# EAGLE board artemis_board (EAGLE 9.5.1), part 1 of 2
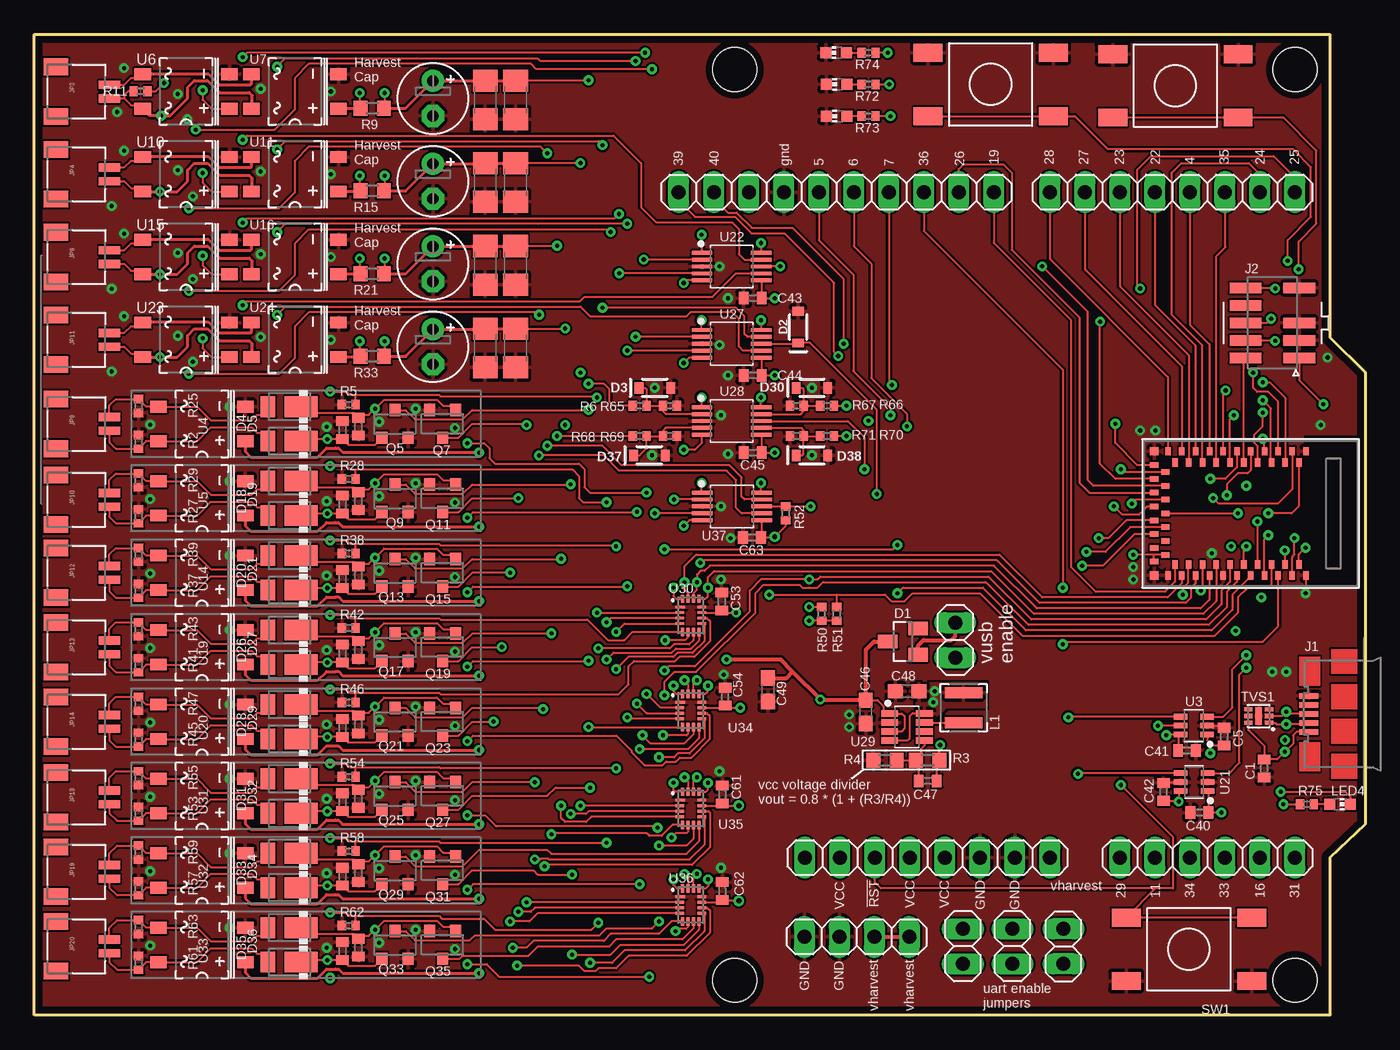
[diagram p6: board, top side]
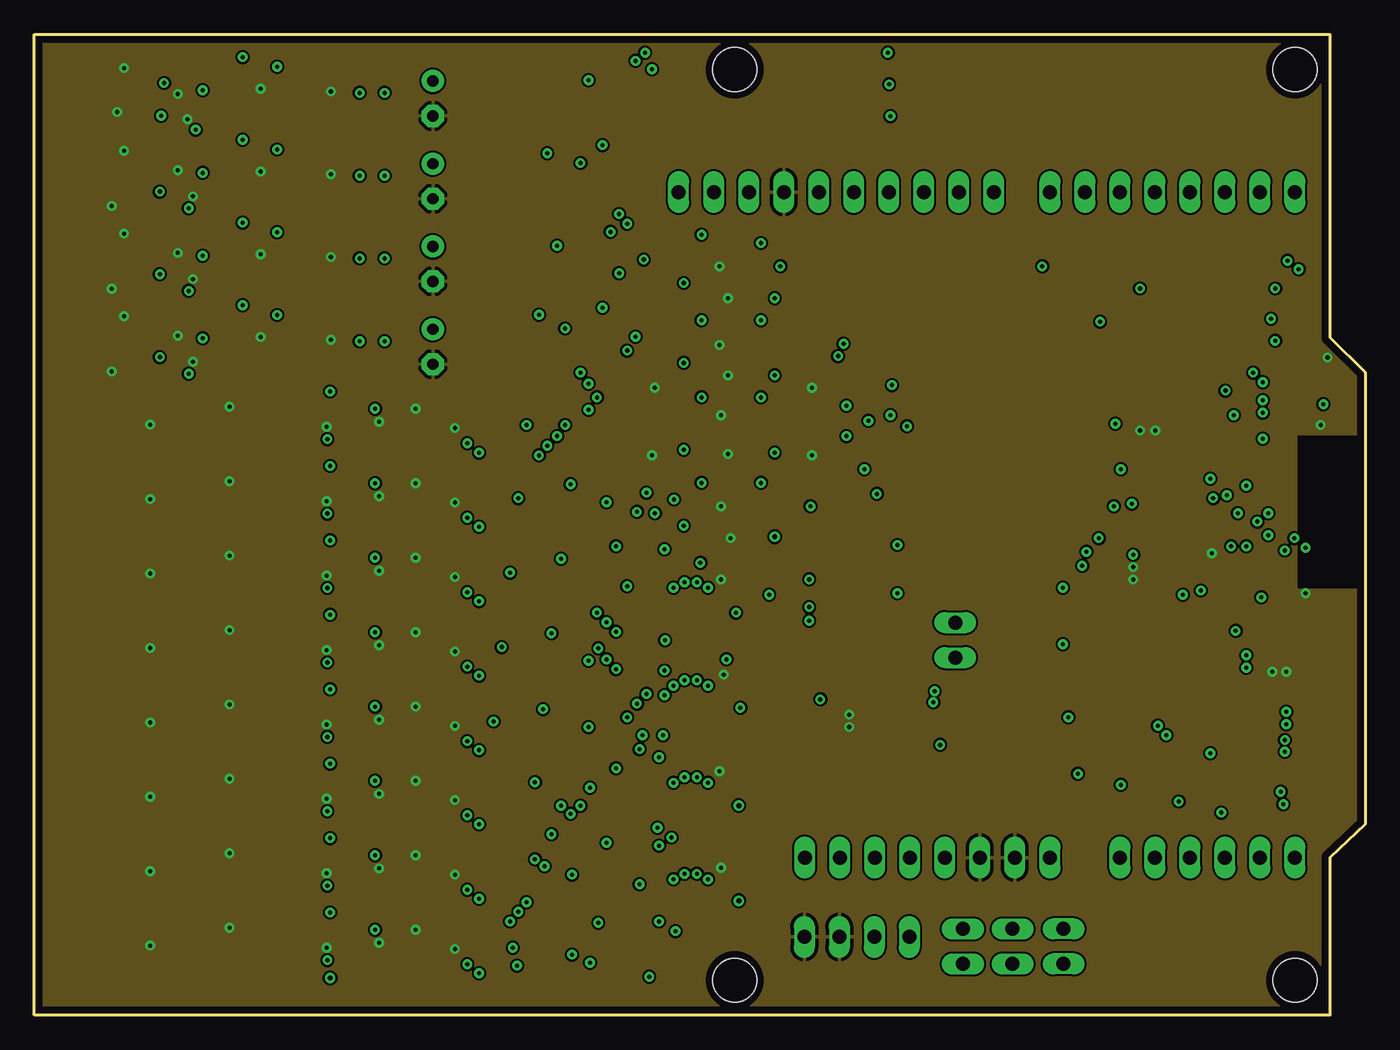
[diagram p7: board, inner layer Route2]
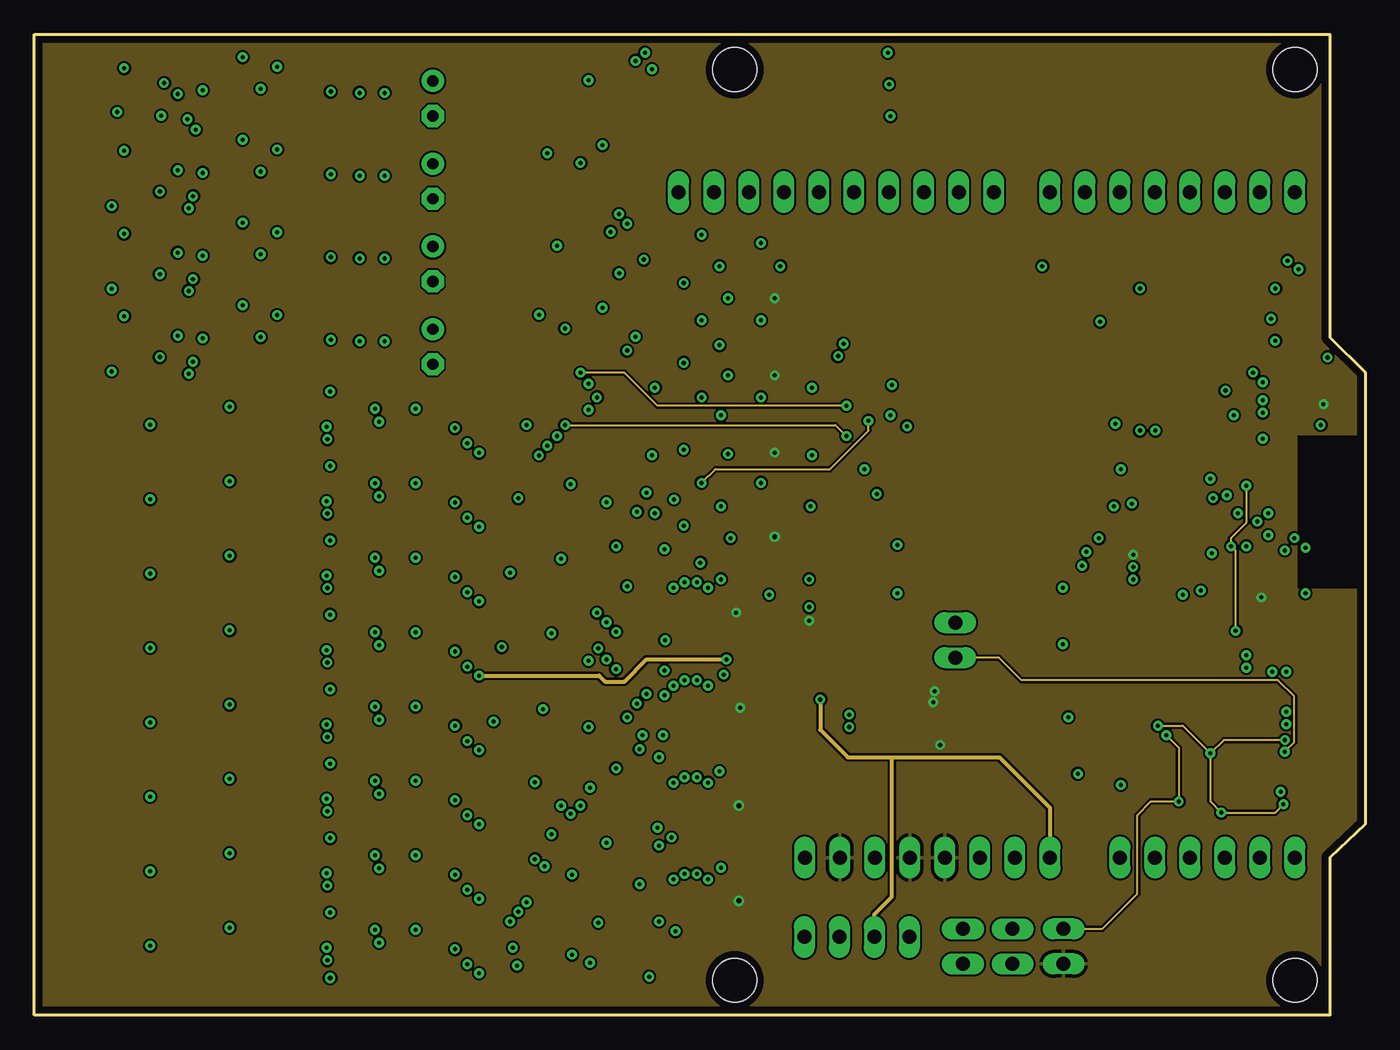
[diagram p8: board, inner layer Route15]
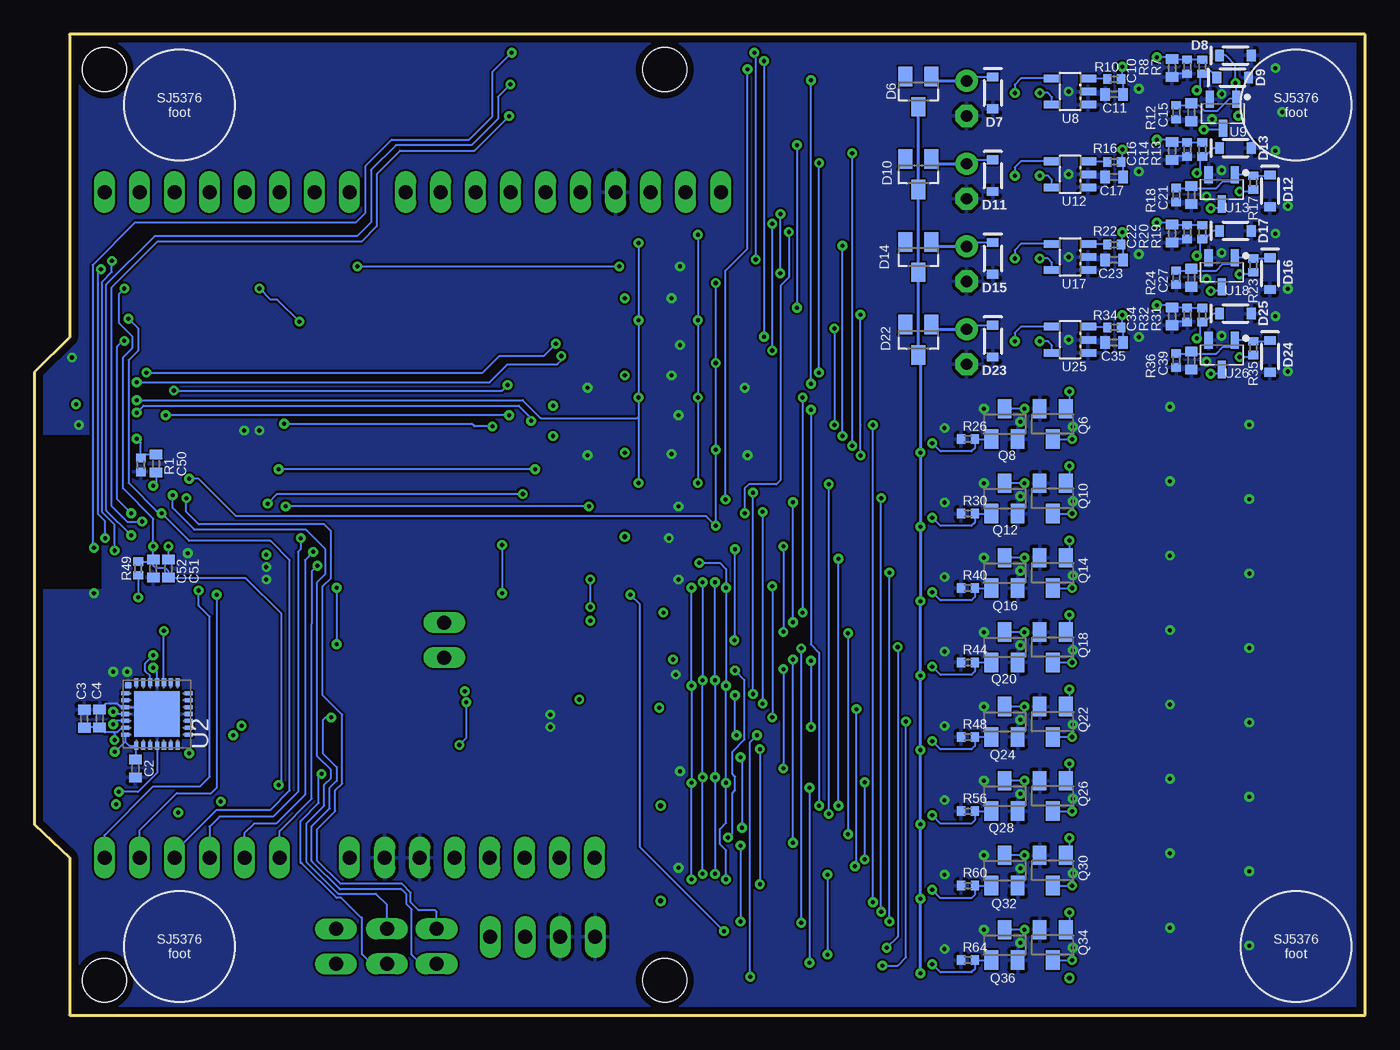
[diagram p9: board, bottom side, seen from below]

Size 96.52 x 71.12 mm. Coordinates in mm from the lower left corner, seen from the top.
Outline: 0,71.12 93.98,71.12 93.98,49.15 96.52,46.61 96.52,13.84 93.98,11.43 93.98,0 0,0 0,71.12
Copper layers (1+2*15+16): Top 0.035mm / dielectric 1.5mm / Route2 0.035mm / dielectric 0.15mm / Route15 0.035mm / dielectric 0.2mm / Bottom 0.035mm
Design rules "default *": minimum track width 6mil, minimum drill 0.3mm, track to track 6mil, track to pad 6mil, pad to pad 6mil, via to via 6mil, smd to smd 6mil, copper to edge 20mil, drill to drill 6mil, minimum pad ring 10mil, minimum via ring 8mil, stop-mask expansion 4mil, vias tented up to drill 0.3mm, thermal gap 10mil
Holes 3.17 mm at 50.8,2.54 91.44,2.54 50.8,68.58 91.44,68.58

## Footprints (pad centres in the part's own frame; a part is rotated, then mirrored left to right if it is on the bottom)
C0402 = smd 0.7 x 0.9: 1 -0.65,0; 2 0.65,0
C1206 = smd 1.6 x 1.8: 1 -1.4,0; 2 1.4,0
E2,5-5 = drill 0.813 pad 1.6: + -1.27,0 | drill 0.813 pad 1.6 octagon: - 1.27,0
C0603 = smd 1.1 x 1: 1 -0.85,0; 2 0.85,0
SOT23 = smd 1 x 1.4: 1 -0.95,-1.1; 2 0.95,-1.1; 3 0,1.1
SOD-323 = smd 0.63 x 0.83: A 1.15,0; C -1.15,0
DFLU1200 = smd 1.05 x 1.5: A -1.55,0 | smd 2.4 x 1.5: K 0.85,0
10118192-0001LF = smd 0.4 x 1.35: 1 -1.29,2.56; 2 -0.64,2.56; 3 0.01,2.56; 4 0.66,2.56; 5 1.31,2.56
FTSH-105-01-F-DV-007-K-P = smd 2.3 x 0.75: P$1 1.95,-2.54; P$2 -1.95,-2.54; P$3 1.95,-1.27; P$4 -1.95,-1.27; P$5 1.95,0; P$6 -1.95,0; P$8 -1.95,1.27; P$9 1.95,2.54; P$10 -1.95,2.54
1X02 = drill 1.016 long: 1 -1.27,0; 2 1.27,0
1X08 = drill 1.016 long: 1 -8.89,0; 2 -6.35,0; 3 -3.81,0; 4 -1.27,0; 5 1.27,0; 6 3.81,0; 7 6.35,0; 8 8.89,0
JST-SH-2 = smd 0.6 x 1.55: 1 -0.5,2.34; 2 0.5,2.34 | smd 1.2 x 1.8: P-MOUNT1 -1.8,-1.535; P-MOUNT2 1.8,-1.535
1X10 = drill 1.016 long: 1 -11.43,0; 2 -8.89,0; 3 -6.35,0; 4 -3.81,0; 5 -1.27,0; 6 1.27,0; 7 3.81,0; 8 6.35,0; 9 8.89,0; 10 11.43,0
1X06 = drill 1.016 long: 1 -6.35,0; 2 -3.81,0; 3 -1.27,0; 4 1.27,0; 5 3.81,0; 6 6.35,0
1X04 = drill 1.016 long: 1 -3.81,0; 2 -1.27,0; 3 1.27,0; 4 3.81,0
LQH3NPNXXXXMEX = smd 0.8 x 2.7: P$1 -1.1,0; P$2 1.1,0
CHIP-LED0603 = smd 0.8 x 0.8: A 0,-0.75; C 0,0.75
2N7002K-7 = smd 0.8 x 0.9: D 0,1; G -0.95,-1; S 0.95,-1
BSS138K = smd 1 x 1.4: D 0,1.1; G -0.95,-1.1; S 0.95,-1.1
R0402 = smd 0.6 x 0.7: 1 -0.5,0; 2 0.5,0
R0603 = smd 1 x 1.1: 1 -0.85,0; 2 0.85,0
TE_FSMJSMA = smd 1.3 x 2.1: P$1 -2.3,4.55; P$2 -2.3,-4.55; P$3 2.3,4.55; P$4 2.3,-4.55
RCLAMP3654PATCT = smd 0.3 x 0.6: P$1 -0.5,-0.75; P$2 0,-0.75; P$3 0.5,-0.75; P$4 0.5,0.75; P$5 0,0.75; P$6 -0.5,0.75 | smd 1.3 x 0.45: PAD 0,0
ARTEMIS_FP = smd 0.4 x 0.6: AD16 -4,-3.7; BOOT 1.5,4.5; D0 0.5,-4.5; D1 -0.5,-4.5; D2 -1,-3.7; D3 2,-3.7; D7 -1.5,4.5; D8 -0.5,4.5; D9 2,3.7; D10 1,3.7; D14 -5,3.7; D17 -3.5,-4.5; D36 2.5,-4.5; D38 3,-3.7; D40 2.5,4.5; D41 -2.5,-4.5; GND@1 4.5,4.5; GND@39 -5.5,-4.5; GND@47 -1.5,-4.5; GND@59 4.5,-4.5; RXI-0 3.5,4.5; SWDCK 4,3.7; SWDIO 0,3.7; TXO-0 0.5,4.5; ~AD31 -3,-3.7; ~AD35 -2,3.7; ~D4 -2.5,4.5; ~D5 -1,3.7; ~D18 -4.5,-4.5; ~D19 -5,-3.7; ~D22 -3.5,4.5; ~D23 -4,3.7; ~D24 -3,3.7; ~D27 -4.5,4.5; ~D28 -5.5,4.5; ~D37 3.5,-4.5; ~D39 3,3.7; ~D42 1.5,-4.5; ~D43 1,-3.7; ~D44 4,-3.7; ~D45 -2,-3.7; ~RST 0,-3.7 | smd 0.6 x 0.4: AD34 -6.5,-0.5; D15 -6.5,0.5; VDD@36 -5.7,-3; VDD@37 -6.5,-3.5; XI -6.5,-2.5; XO -5.7,-2; ~AD11 -5.7,-1; ~AD12 -5.7,2; ~AD13 -5.7,1; ~AD29 -6.5,-1.5; ~AD32 -5.7,3; ~AD33/SWO -5.7,0; ~D6 -6.5,3.5; ~D25 -6.5,2.5; ~D26 -6.5,1.5 | smd 0.6 x 0.6: GND@22 -6.5,4.5; GND@38 -6.5,-4.5
MLP28 = smd 0.6 x 0.3: 1 -2.3,1.5; 2 -2.3,1; 3 -2.3,0.5; 4 -2.3,0; 5 -2.3,-0.5; 6 -2.3,-1; 7 -2.3,-1.5; 15 2.3,-1.5; 16 2.3,-1; 17 2.3,-0.5; 18 2.3,0; 19 2.3,0.5; 20 2.3,1; 21 2.3,1.5 | smd 0.3 x 0.6: 8 -1.5,-2.3; 9 -1,-2.3; 10 -0.5,-2.3; 11 0,-2.3; 12 0.5,-2.3; 13 1,-2.3; 14 1.5,-2.3; 22 1.5,2.3; 23 1,2.3; 24 0.5,2.3; 25 0,2.3; 26 -0.5,2.3; 27 -1,2.3; 28 -1.5,2.3 | smd 3.3 x 3.3: EXP 0,0 | smd 0.435 x 0.435: M -2.103,2.103
SOT65P210X110-6N = smd 0.988 x 0.41: 1 -0.97,0.65; 2 -0.97,0; 3 -0.97,-0.65; 4 0.97,-0.65; 5 0.97,0; 6 0.97,0.65
CDBHDXX0L-G = smd 0.85 x 1.2: P$1 1.25,3.15; P$2 -1.25,3.15; P$3 -1.25,-3.15; P$4 1.25,-3.15
SOT23-5 = smd 0.55 x 1.2: 1 -0.95,-1.3; 2 0,-1.3; 3 0.95,-1.3; 4 0.95,1.3; 5 -0.95,1.3
TN2106K1-G = smd 1.24 x 0.589: D 1.056,0; G -1.056,0.95; S -1.056,-0.95
SOP50P490X110-10N = smd 1.471 x 0.28: 1 -2.15,1; 2 -2.15,0.5; 3 -2.15,0; 4 -2.15,-0.5; 5 -2.15,-1; 6 2.15,-1; 7 2.15,-0.5; 8 2.15,0; 9 2.15,0.5; 10 2.15,1
SOP65P280X145-8N = smd 1.209 x 0.475: 1 -1.253,0.975; 2 -1.253,0.325; 3 -1.253,-0.325; 4 -1.253,-0.975; 5 1.253,-0.975; 6 1.253,-0.325; 7 1.253,0.325; 8 1.253,0.975
UQFN16-RSV0016A = smd 0.7 x 0.2: P$1 -0.75,0.6 | smd 0.6 x 0.2: P$2 -0.8,0.2; P$3 -0.8,-0.2; P$4 -0.8,-0.6; P$9 0.8,-0.6; P$10 0.8,-0.2; P$11 0.8,0.2; P$12 0.8,0.6 | smd 0.2 x 0.6: P$5 -0.6,-1.2; P$6 -0.2,-1.2; P$7 0.2,-1.2; P$8 0.6,-1.2; P$13 0.6,1.2; P$14 0.2,1.2; P$15 -0.2,1.2; P$16 -0.6,1.2

## Placement (x,y rotation side)
C1  1u  [C0402]  89.2,17.9 270 top
C2  1u  [C0402]  89.2,17.9 270 bottom
C3  100n  [C0402]  92.9,21.5 90 bottom
C4  1u  [C0402]  91.79,21.52 90 bottom
C5  100n  [C0402]  86.3,20.2 90 top
C6  10n  [C0402]  22.35,42.43 90 top
C7  10n  [C0402]  23.5,42.68 270 top
C8  10n  [C0402]  22.35,37.03 90 top
C9  10n  [C0402]  23.5,37.28 270 top
C10  1n  [C0402]  14,68.68 270 bottom
C11  1n  [C0402]  18.2,66.78 180 bottom
C12  [C1206]  34.9,66.38 270 top
C13  DNP  [E2,5-5]  28.9,66.48 270 top
C14  [C1206]  32.7,66.38 270 top
C15  10n  [C0402]  12.6,65.48 270 bottom
C16  1n  [C0402]  14,62.68 270 bottom
C17  1n  [C0402]  18.2,60.78 180 bottom
C18  [C1206]  34.9,60.38 270 top
C19  DNP  [E2,5-5]  28.9,60.48 270 top
C20  [C1206]  32.7,60.38 270 top
C21  10n  [C0402]  12.6,59.48 270 bottom
C22  1n  [C0402]  14,56.68 270 bottom
C23  1n  [C0402]  18.2,54.78 180 bottom
C24  [C1206]  34.9,54.38 270 top
C25  DNP  [E2,5-5]  28.9,54.48 270 top
C26  [C1206]  32.7,54.38 270 top
C27  10n  [C0402]  12.6,53.48 270 bottom
C28  10n  [C0402]  22.35,31.63 90 top
C29  10n  [C0402]  23.5,31.88 270 top
C30  10n  [C0402]  22.35,26.23 90 top
C31  10n  [C0402]  23.5,26.48 270 top
C32  10n  [C0402]  22.35,20.83 90 top
C33  10n  [C0402]  23.5,21.08 270 top
C34  1n  [C0402]  14,50.68 270 bottom
C35  1n  [C0402]  18.2,48.78 180 bottom
C36  [C1206]  34.9,48.38 270 top
C37  DNP  [E2,5-5]  28.9,48.48 270 top
C38  [C1206]  32.7,48.38 270 top
C39  10n  [C0402]  12.6,47.48 270 bottom
C40  100n  [C0402]  84.5,14.7 180 top
C41  10n  [C0402]  83.6,19.2 0 top
C42  10n  [C0402]  81.9,16.2 90 top
C43  10n  [C0402]  52.1,52 180 top
C44  10n  [C0402]  52.1,46.4 180 top
C45  10n  [C0402]  52.1,40.8 180 top
C46  4.7u  [C0603]  60.3,22 270 top
C47  22p  [C0402]  64.8,17 180 top
C48  4.7u  [C0603]  63.3,23.5 180 top
C49  10u  [C0603]  53.2,23.6 270 top
C50  100n  [C0402]  87.7,40 90 bottom
C51  100n  [C0402]  86.8,32.4 270 bottom
C52  1n  [C0402]  87.9,32.4 270 bottom
C53  10n  [C0402]  49.85,30 90 top
C54  10n  [C0402]  50.1,23.1 90 top
C55  10n  [C0402]  22.35,15.45 90 top
C56  10n  [C0402]  23.5,15.7 270 top
C57  10n  [C0402]  22.35,10.05 90 top
C58  10n  [C0402]  23.5,10.3 270 top
C59  10n  [C0402]  22.35,4.65 90 top
C60  10n  [C0402]  23.5,4.9 270 top
C61  10n  [C0402]  49.9,16 90 top
C62  10n  [C0402]  49.9,9 90 top
C63  10n  [C0402]  52.05,34.65 180 top
D1  BAT54  [SOT23]  63,27.1 90 top
D2  3.3V  [SOD-323]  55.4,49.9 90 top
D3  3.3V  [SOD-323]  45,45.5 0 top
D4  DFLU1200  [DFLU1200]  18.5,41.63 0 top
D5  DFLU1200  [DFLU1200]  18.5,44.13 0 top
D6  BAT54  [SOT23]  32.4,66.98 180 bottom
D7  3.3V  [SOD-323]  27,66.88 270 bottom
D8  3.3V  [SOD-323]  9.4,69.6 0 bottom
D9  3.3V  [SOD-323]  9.6,68 0 bottom
D10  BAT54  [SOT23]  32.4,60.98 180 bottom
D11  3.3V  [SOD-323]  27,60.88 270 bottom
D12  3.3V  [SOD-323]  6.9,59.78 270 bottom
D13  3.3V  [SOD-323]  9.4,62.88 0 bottom
D14  BAT54  [SOT23]  32.4,54.98 180 bottom
D15  3.3V  [SOD-323]  27,54.88 270 bottom
D16  3.3V  [SOD-323]  6.9,53.78 270 bottom
D17  3.3V  [SOD-323]  9.4,56.88 0 bottom
D18  DFLU1200  [DFLU1200]  18.5,36.23 0 top
D19  DFLU1200  [DFLU1200]  18.5,38.73 0 top
D20  DFLU1200  [DFLU1200]  18.5,30.83 0 top
D21  DFLU1200  [DFLU1200]  18.5,33.33 0 top
D22  BAT54  [SOT23]  32.4,48.98 180 bottom
D23  3.3V  [SOD-323]  27,48.88 270 bottom
D24  3.3V  [SOD-323]  6.9,47.78 270 bottom
D25  3.3V  [SOD-323]  9.4,50.88 0 bottom
D26  DFLU1200  [DFLU1200]  18.5,25.43 0 top
D27  DFLU1200  [DFLU1200]  18.5,27.93 0 top
D28  DFLU1200  [DFLU1200]  18.5,20.03 0 top
D29  DFLU1200  [DFLU1200]  18.5,22.53 0 top
D30  3.3V  [SOD-323]  56.4,45.5 0 top
D31  DFLU1200  [DFLU1200]  18.5,14.65 0 top
D32  DFLU1200  [DFLU1200]  18.5,17.15 0 top
D33  DFLU1200  [DFLU1200]  18.5,9.25 0 top
D34  DFLU1200  [DFLU1200]  18.5,11.75 0 top
D35  DFLU1200  [DFLU1200]  18.5,3.85 0 top
D36  DFLU1200  [DFLU1200]  18.5,6.35 0 top
D37  3.3V  [SOD-323]  44.6,40.6 0 top
D38  3.3V  [SOD-323]  56.4,40.6 0 top
J1  10118192-0001LF  [10118192-0001LF]  95,21.84 90 top
J2  FTSH-105-01-F-DV-007-K-P  [FTSH-105-01-F-DV-007-K-P]  89.8,50.2 0 top
JP1  [1X02]  66.8,27.2 270 top
JP2  [1X08]  82.55,59.69 0 top
JP3  JST-SH-2  [JST-SH-2]  3.1,66.98 270 top
JP4  JST-SH-2  [JST-SH-2]  3.1,60.98 270 top
JP5  [1X10]  58.17,59.69 0 top
JP6  [1X06]  85.09,11.43 0 top
JP7  [1X08]  64.77,11.43 0 top
JP8  JST-SH-2  [JST-SH-2]  3.1,42.88 270 top
JP9  JST-SH-2  [JST-SH-2]  3.1,54.98 270 top
JP10  JST-SH-2  [JST-SH-2]  3.1,37.38 270 top
JP11  JST-SH-2  [JST-SH-2]  3.1,48.98 270 top
JP12  JST-SH-2  [JST-SH-2]  3.1,32.08 270 top
JP13  JST-SH-2  [JST-SH-2]  3.1,26.68 270 top
JP14  JST-SH-2  [JST-SH-2]  3.1,21.28 270 top
JP15  [1X02]  67.35,5 270 top
JP16  [1X02]  70.95,5 270 top
JP17  [1X02]  74.65,5 90 top
JP18  JST-SH-2  [JST-SH-2]  3.1,15.8 270 top
JP19  JST-SH-2  [JST-SH-2]  3.1,10.4 270 top
JP20  JST-SH-2  [JST-SH-2]  3.1,5 270 top
JP21  [1X04]  59.65,5.68 180 top
L1  22u  [LQH3NPNXXXXMEX]  67.4,22.3 90 top
LED1  [CHIP-LED0603]  58.2,65.2 90 top
LED2  [CHIP-LED0603]  58.2,67.5 90 top
LED3  [CHIP-LED0603]  58.15,69.8 90 top
LED4  [CHIP-LED0603]  94.7,15.3 270 top
Q5  2N7002K-7  [2N7002K-7]  26.15,42.88 0 top
Q6  BSS138K  [BSS138K]  22.65,42.88 180 bottom
Q7  2N7002K-7  [2N7002K-7]  29.6,42.88 180 top
Q8  BSS138K  [BSS138K]  26.15,42.88 0 bottom
Q9  2N7002K-7  [2N7002K-7]  26.15,37.48 0 top
Q10  BSS138K  [BSS138K]  22.65,37.48 180 bottom
Q11  2N7002K-7  [2N7002K-7]  29.6,37.48 180 top
Q12  BSS138K  [BSS138K]  26.15,37.48 0 bottom
Q13  2N7002K-7  [2N7002K-7]  26.15,32.08 0 top
Q14  BSS138K  [BSS138K]  22.65,32.08 180 bottom
Q15  2N7002K-7  [2N7002K-7]  29.6,32.08 180 top
Q16  BSS138K  [BSS138K]  26.15,32.08 0 bottom
Q17  2N7002K-7  [2N7002K-7]  26.15,26.68 0 top
Q18  BSS138K  [BSS138K]  22.65,26.68 180 bottom
Q19  2N7002K-7  [2N7002K-7]  29.6,26.68 180 top
Q20  BSS138K  [BSS138K]  26.15,26.68 0 bottom
Q21  2N7002K-7  [2N7002K-7]  26.15,21.28 0 top
Q22  BSS138K  [BSS138K]  22.65,21.28 180 bottom
Q23  2N7002K-7  [2N7002K-7]  29.6,21.28 180 top
Q24  BSS138K  [BSS138K]  26.15,21.28 0 bottom
Q25  2N7002K-7  [2N7002K-7]  26.15,15.9 0 top
Q26  BSS138K  [BSS138K]  22.65,15.9 180 bottom
Q27  2N7002K-7  [2N7002K-7]  29.6,15.9 180 top
Q28  BSS138K  [BSS138K]  26.15,15.9 0 bottom
Q29  2N7002K-7  [2N7002K-7]  26.15,10.5 0 top
Q30  BSS138K  [BSS138K]  22.65,10.5 180 bottom
Q31  2N7002K-7  [2N7002K-7]  29.6,10.5 180 top
Q32  BSS138K  [BSS138K]  26.15,10.5 0 bottom
Q33  2N7002K-7  [2N7002K-7]  26.15,5.1 0 top
Q34  BSS138K  [BSS138K]  22.65,5.1 180 bottom
Q35  2N7002K-7  [2N7002K-7]  29.6,5.1 180 top
Q36  BSS138K  [BSS138K]  26.15,5.1 0 bottom
R1  220k  [R0402]  88.8,39.9 90 bottom
R2  1M  [R0402]  7.55,41.58 270 top
R3  360k  [R0603]  64.8,18.5 0 top
R4  240k  [R0603]  61.7,18.5 0 top
R5  100k  [R0402]  22.8,44.28 0 top
R6  180k 1%  [R0402]  43.9,44.2 180 top
R7  1M 1%  [R0402]  11.8,68.78 270 bottom
R8  150k 1%  [R0402]  12.9,68.78 90 bottom
R9  3.3 1%  [R0603]  24.5,65.78 0 top
R10  150k 1%  [R0402]  18.2,67.88 180 bottom
R11  10k  [R0402]  7.7,67 180 top
R12  150K 1%  [R0402]  13.7,65.48 90 bottom
R13  1M 1%  [R0402]  11.8,62.78 270 bottom
R14  150k 1%  [R0402]  12.9,62.78 90 bottom
R15  3.3 1%  [R0603]  24.5,59.78 0 top
R16  150k 1%  [R0402]  18.2,61.88 180 bottom
R17  10k  [R0402]  8.1,60.38 270 bottom
R18  150K 1%  [R0402]  13.7,59.48 90 bottom
R19  1M 1%  [R0402]  11.8,56.78 270 bottom
R20  150k 1%  [R0402]  12.9,56.78 90 bottom
R21  3.3 1%  [R0603]  24.5,53.78 0 top
R22  150k 1%  [R0402]  18.2,55.88 180 bottom
R23  10k  [R0402]  8.1,54.38 270 bottom
R24  150K 1%  [R0402]  13.7,53.48 90 bottom
R25  1M  [R0402]  7.55,44.18 90 top
R26  100k  [R0402]  28.8,41.78 0 bottom
R27  1M  [R0402]  7.55,36.18 270 top
R28  100k  [R0402]  22.8,38.88 0 top
R29  1M  [R0402]  7.55,38.78 90 top
R30  100k  [R0402]  28.8,36.38 0 bottom
R31  1M 1%  [R0402]  11.8,50.78 270 bottom
R32  150k 1%  [R0402]  12.9,50.78 90 bottom
R33  3.3 1%  [R0603]  24.5,47.78 0 top
R34  150k 1%  [R0402]  18.2,49.88 180 bottom
R35  10k  [R0402]  8.1,48.38 270 bottom
R36  150K 1%  [R0402]  13.7,47.48 90 bottom
R37  1M  [R0402]  7.55,30.78 270 top
R38  100k  [R0402]  22.8,33.48 0 top
R39  1M  [R0402]  7.55,33.38 90 top
R40  100k  [R0402]  28.8,30.98 0 bottom
R41  1M  [R0402]  7.55,25.38 270 top
R42  100k  [R0402]  22.8,28.08 0 top
R43  1M  [R0402]  7.55,27.98 90 top
R44  100k  [R0402]  28.8,25.58 0 bottom
R45  1M  [R0402]  7.55,19.98 270 top
R46  100k  [R0402]  22.8,22.68 0 top
R47  1M  [R0402]  7.55,22.58 90 top
R48  100k  [R0402]  28.8,20.18 0 bottom
R49  100k  [R0402]  89,32.4 270 bottom
R50  1M  [R0402]  57.1,29.1 270 top
R51  1M  [R0402]  58.2,29.1 270 top
R52  1M  [R0402]  54.5,36.4 270 top
R53  1M  [R0402]  7.55,14.6 270 top
R54  100k  [R0402]  22.8,17.3 0 top
R55  1M  [R0402]  7.55,17.2 90 top
R56  100k  [R0402]  28.8,14.8 0 bottom
R57  1M  [R0402]  7.55,9.2 270 top
R58  100k  [R0402]  22.8,11.9 0 top
R59  1M  [R0402]  7.55,11.8 90 top
R60  100k  [R0402]  28.8,9.4 0 bottom
R61  1M  [R0402]  7.55,3.8 270 top
R62  100k  [R0402]  22.8,6.5 0 top
R63  1M  [R0402]  7.55,6.4 90 top
R64  100k  [R0402]  28.8,4 0 bottom
R65  20K 1%  [R0402]  46.1,44.2 180 top
R66  180k 1%  [R0402]  57.5,44.2 0 top
R67  20K 1%  [R0402]  55.3,44.2 0 top
R68  180k 1%  [R0402]  43.9,42 180 top
R69  20K 1%  [R0402]  46.1,42 180 top
R70  180k 1%  [R0402]  57.5,42 0 top
R71  20K 1%  [R0402]  55.3,42 0 top
R72  330  [R0402]  60.5,67.5 180 top
R73  330  [R0402]  60.5,65.2 180 top
R74  330  [R0402]  60.5,69.8 180 top
R75  330  [R0402]  92.3,15.3 0 top
SW1  [TE_FSMJSMA]  83.74,4.78 90 top
SW2  [TE_FSMJSMA]  82.76,67.4 90 top
SW3  [TE_FSMJSMA]  69.36,67.5 90 top
TVS1  RCLAMP3654PAT  [RCLAMP3654PATCT]  88.8,21.7 90 top
U1  ARTEMIS_MODULESMD  [ARTEMIS_FP]  87.73,36.39 0 top
U2  CP2102  [MLP28]  87.63,21.84 0 bottom
U3  74AXP1T45GWH  [SOT65P210X110-6N]  84.1,21 180 top
U4  CDBHD140L-G  [CDBHDXX0L-G]  12.15,42.88 270 top
U5  CDBHD140L-G  [CDBHDXX0L-G]  12.15,37.48 270 top
U6  CDBHD140L-G  [CDBHDXX0L-G]  11,66.98 270 top
U7  CDBHD140L-G  [CDBHDXX0L-G]  18.9,66.98 270 top
U8  MAX9938  [SOT23-5]  21.4,66.98 90 bottom
U9  TN2106K1-G  [TN2106K1-G]  10.3,65.38 270 bottom
U10  CDBHD140L-G  [CDBHDXX0L-G]  11,60.98 270 top
U11  CDBHD140L-G  [CDBHDXX0L-G]  18.9,60.98 270 top
U12  MAX9938  [SOT23-5]  21.4,60.98 90 bottom
U13  TN2106K1-G  [TN2106K1-G]  10.4,59.88 270 bottom
U14  CDBHD140L-G  [CDBHDXX0L-G]  12.15,32.08 270 top
U15  CDBHD140L-G  [CDBHDXX0L-G]  11,54.98 270 top
U16  CDBHD140L-G  [CDBHDXX0L-G]  18.9,54.98 270 top
U17  MAX9938  [SOT23-5]  21.4,54.98 90 bottom
U18  TN2106K1-G  [TN2106K1-G]  10.4,53.88 270 bottom
U19  CDBHD140L-G  [CDBHDXX0L-G]  12.15,26.68 270 top
U20  CDBHD140L-G  [CDBHDXX0L-G]  12.15,21.28 270 top
U21  74AXP1T45GWH  [SOT65P210X110-6N]  84.12,16.91 180 top
U22  TMUX1104DGSR  [SOP50P490X110-10N]  50.58,54.29 0 top
U23  CDBHD140L-G  [CDBHDXX0L-G]  11,48.98 270 top
U24  CDBHD140L-G  [CDBHDXX0L-G]  18.9,48.98 270 top
U25  MAX9938  [SOT23-5]  21.4,48.98 90 bottom
U26  TN2106K1-G  [TN2106K1-G]  10.4,47.88 270 bottom
U27  TMUX1104DGSR  [SOP50P490X110-10N]  50.58,48.69 0 top
U28  TMUX1104DGSR  [SOP50P490X110-10N]  50.58,43.09 0 top
U29  TPS62120  [SOP65P280X145-8N]  63.3,20.9 0 top
U30  TMUX1108RSVR  [UQFN16-RSV0016A]  47.6,29 0 top
U31  CDBHD140L-G  [CDBHDXX0L-G]  12.15,15.9 270 top
U32  CDBHD140L-G  [CDBHDXX0L-G]  12.15,10.5 270 top
U33  CDBHD140L-G  [CDBHDXX0L-G]  12.15,5.1 270 top
U34  TMUX1108RSVR  [UQFN16-RSV0016A]  47.6,22.1 0 top
U35  TMUX1108RSVR  [UQFN16-RSV0016A]  47.6,15 0 top
U36  TMUX1108RSVR  [UQFN16-RSV0016A]  47.6,8 0 top
U37  TMUX1104DGSR  [SOP50P490X110-10N]  50.6,36.9 0 top